# Altium schematic sheet OL_sensor.SchDoc: main_assy PCB
size A4
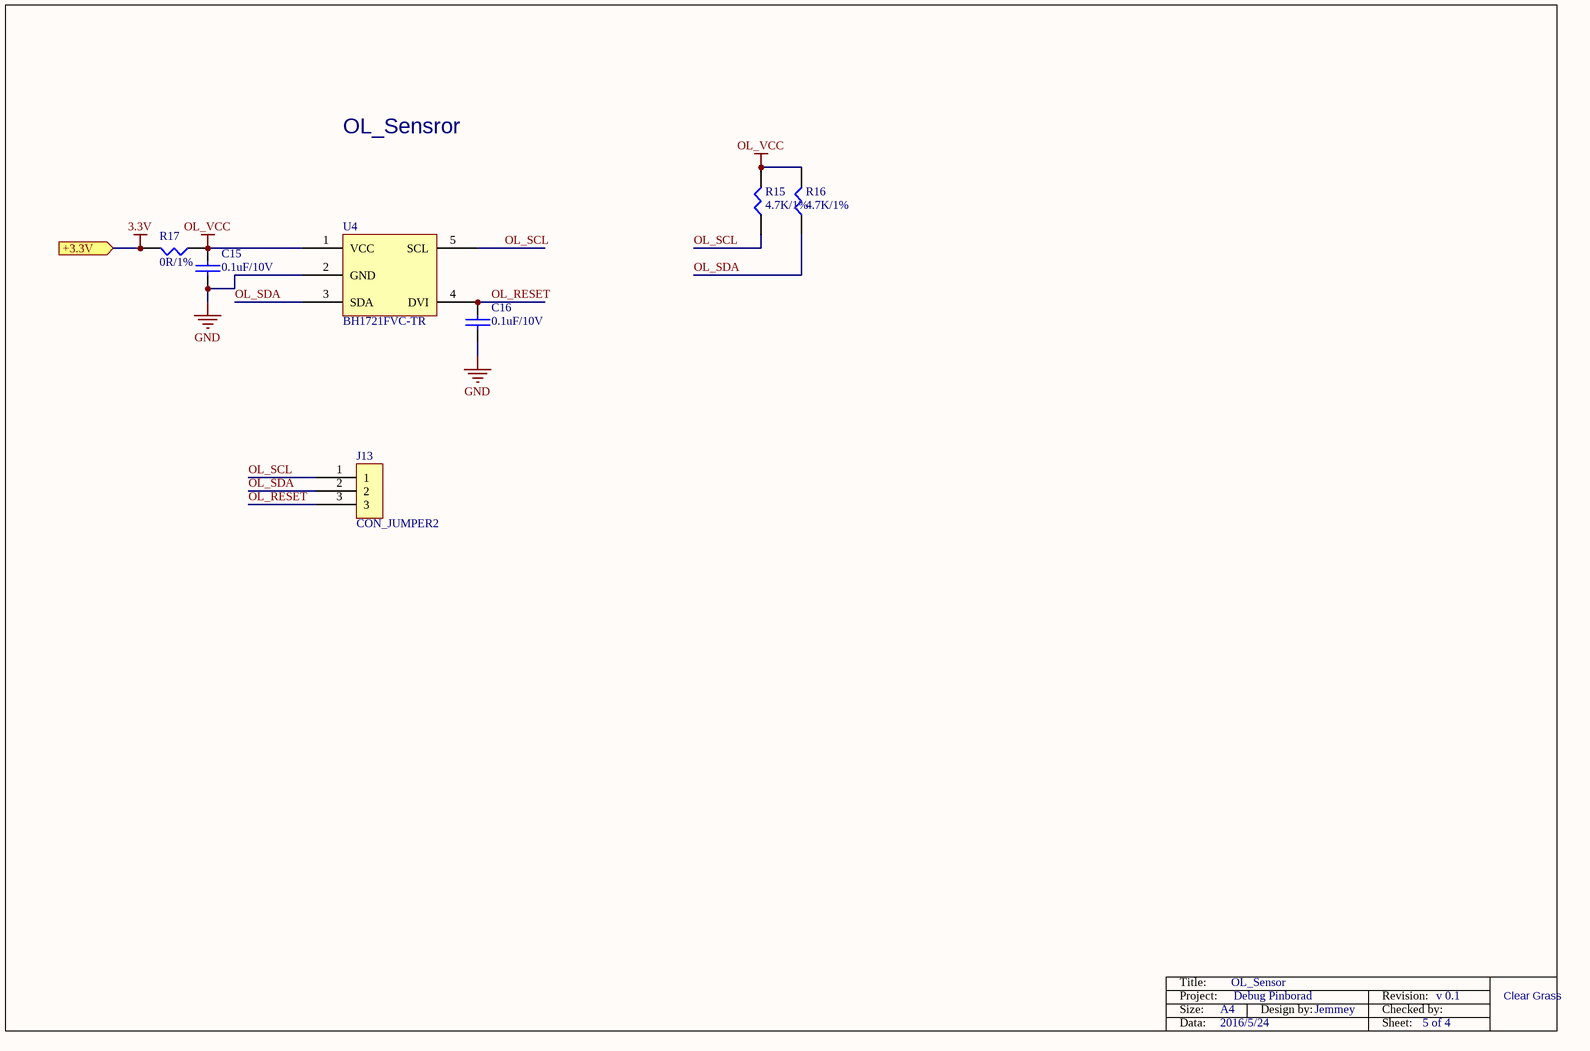
[diagram p0: OL_sensor.SchDoc]

## Parts
C15  0.1uF/10V  [0402C]
C16  0.1uF/10V  [0402C]
J13  CON_JUMPER2
R15  4.7K/1%  [0402R]
R16  4.7K/1%  [0402R]
R17  0R/1%  [0402R]
U4  BH1721FVC-TR  [WSOF5]

## Ports
+3.3V (in)

## Nets
3.3V: R17.2 ; port +3.3V
GND: C15.2 C16.2 U4.2(GND)
OL_VCC: C15.1 R15.2 R16.2 R17.1 U4.1(VCC)
OL_RESET: C16.1 J13.3 U4.4(DVI)
OL_SCL: J13.1 R15.1 U4.5(SCL)
OL_SDA: J13.2 R16.1 U4.3(SDA)

## Notes on the sheet
- OL_Sensror
- Title:
- OL_Sensor
- Project:
- Size:
- Data:
- A4
- 2016/5/24
- Debug Pinborad
- Design by:
- Jemmey
- Revision:
- Sheet:
- Checked by:
- 5 of 4
- v 0.1
- Clear Grass

## Library data of the parts
C15 C16 = CAP: 厂家：Murata，型号：
R15-R17 = RES1: 厂家：Yageo，型号：RC0402FR-0710KL